# EAGLE schematic DEPDisc Base rev1 v4 (EAGLE 9.7.0)
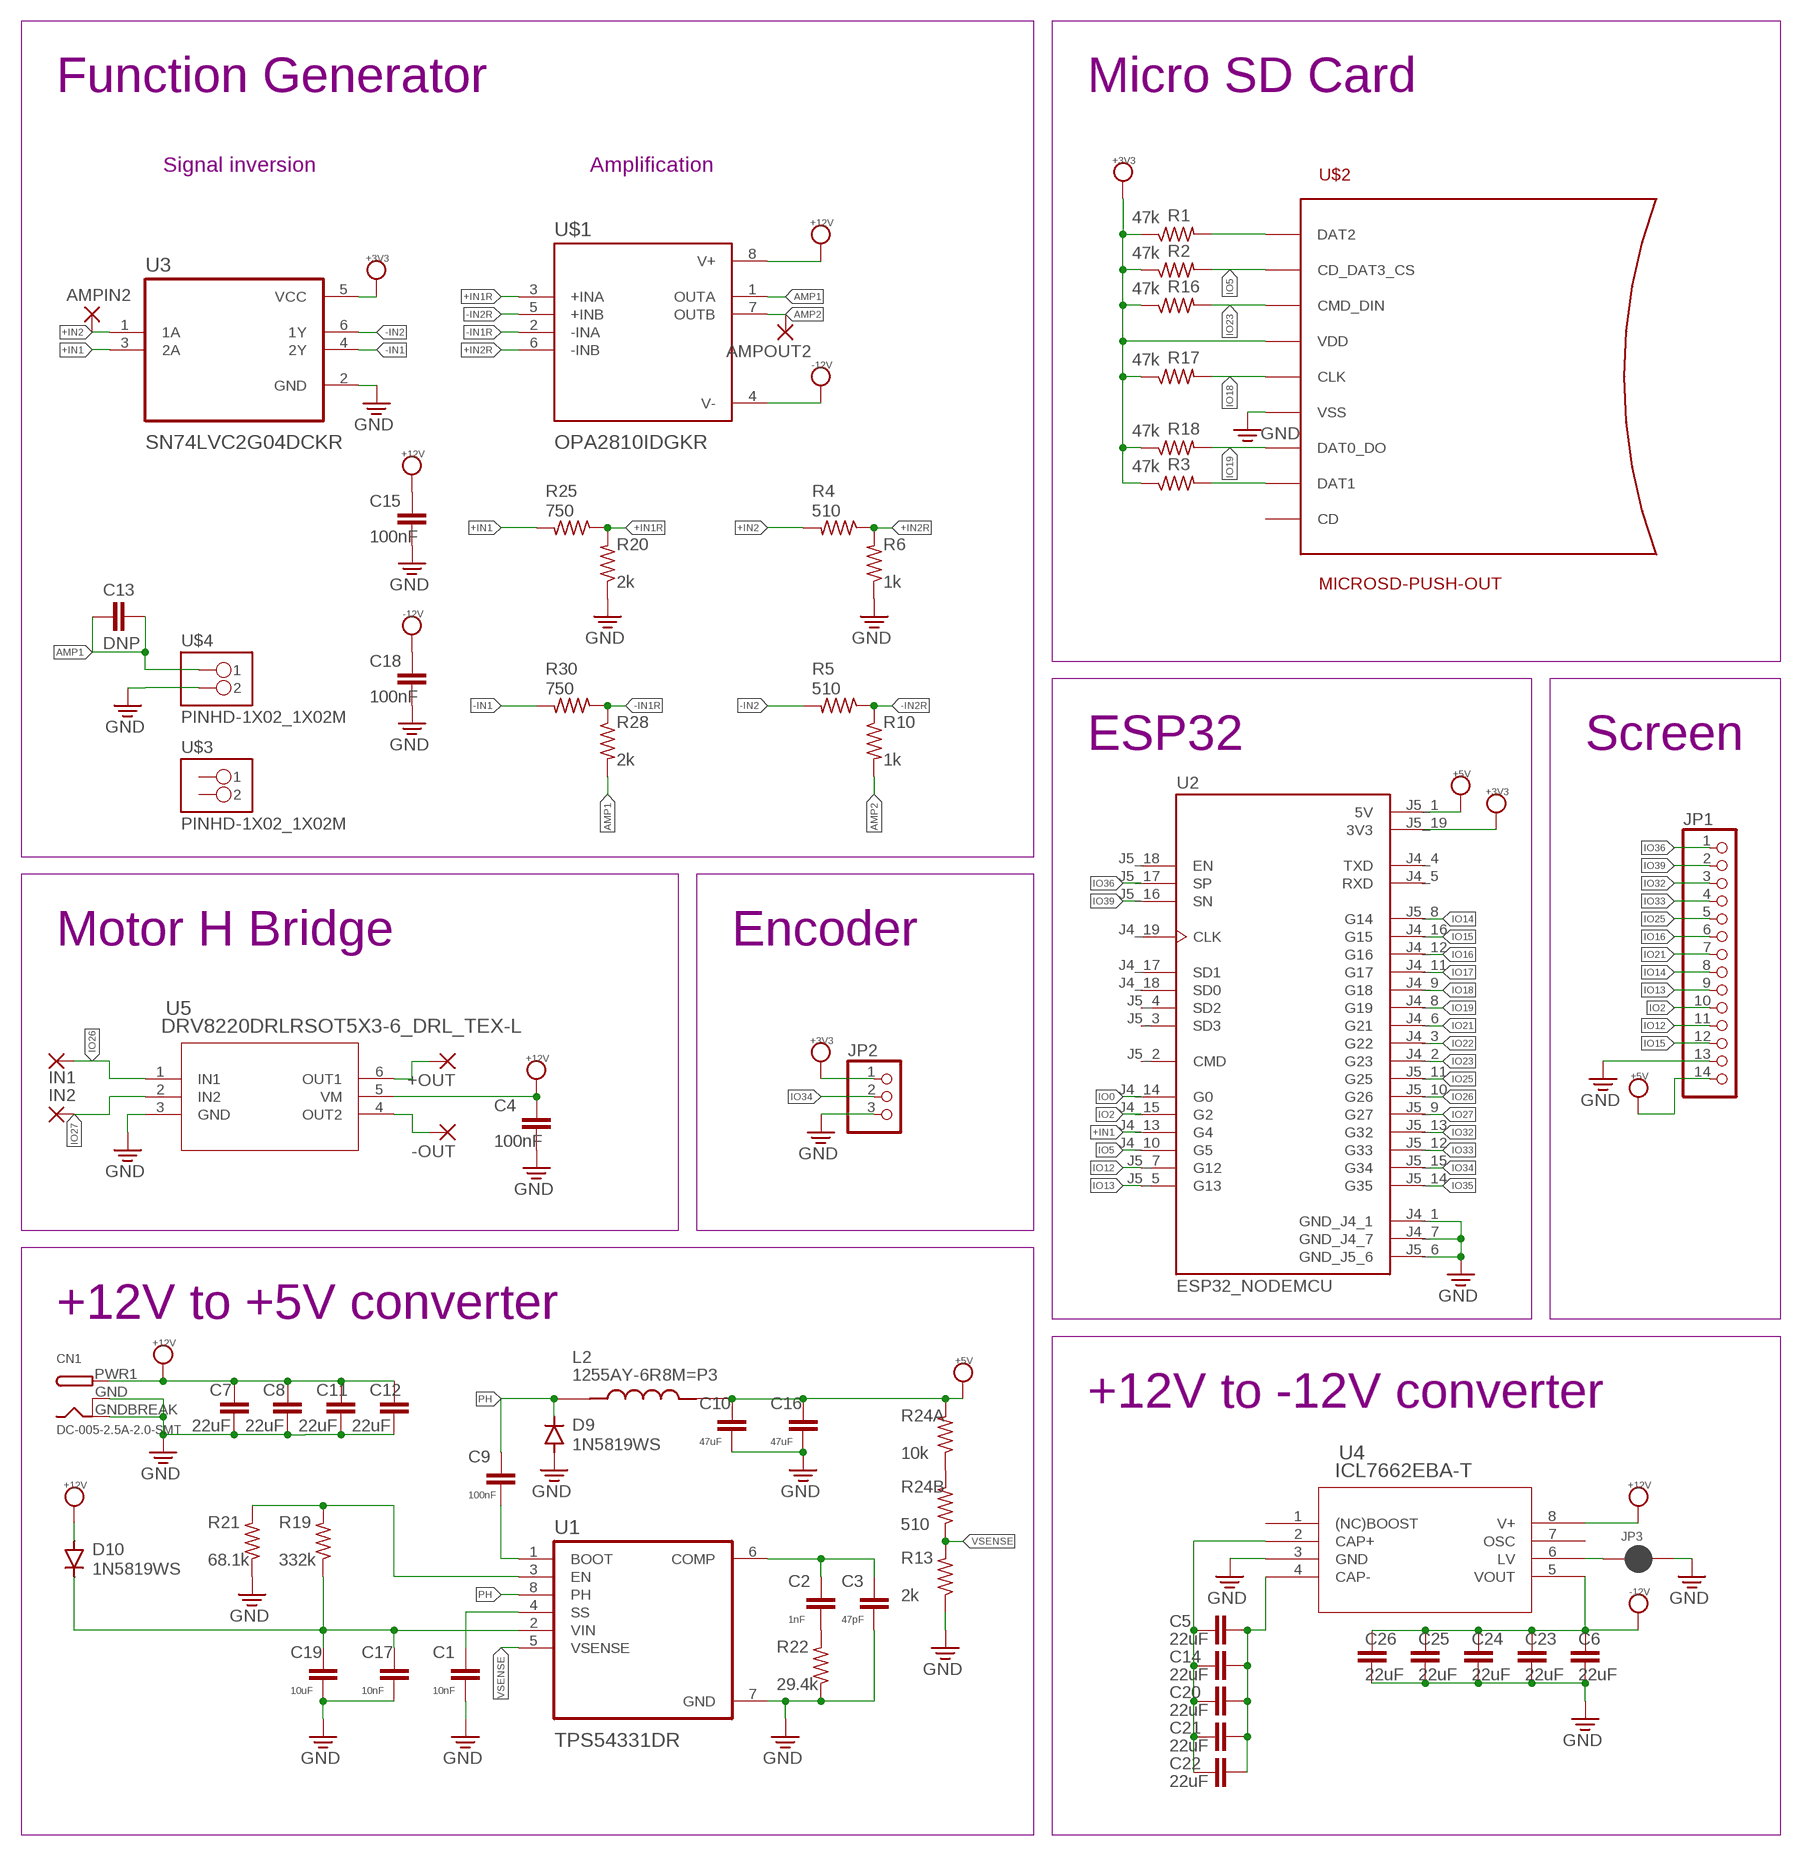
[diagram p0: schematic, sheet 1]

## Parts
+OUT  2,54/1,1  [2,54/1,1]
-OUT  2,54/1,1  [2,54/1,1]
AMPIN2  1,6/0,8  [1,6/0,8]
AMPOUT2  1,6/0,8  [1,6/0,8]
C1  10nF  C-EUC0603K  [C0603K]
C2  1nF  C-EUC0603K  [C0603K]
C3  47pF  C-EUC0603K  [C0603K]
C4  100nF  C-EUC0603K  [C0603K]
C5  22uF  C-EUC0805K  [C0805K]
C6  22uF  C-EUC0805K  [C0805K]
C7  22uF  C-EUC0805K  [C0805K]
C8  22uF  C-EUC0805K  [C0805K]
C9  100nF  C-EUC0603K  [C0603K]
C10  47uF  C-EUC0603K  [C0603K]
C11  22uF  C-EUC0805K  [C0805K]
C12  22uF  C-EUC0805K  [C0805K]
C13  DNP  C-EUC0805K  [C0805K]
C14  22uF  C-EUC0805K  [C0805K]
C15  100nF  C-EUC0603K  [C0603K]
C16  47uF  C-EUC0603K  [C0603K]
C17  10nF  C-EUC0603K  [C0603K]
C18  100nF  C-EUC0603K  [C0603K]
C19  10uF  C-EUC0603K  [C0603K]
C20  22uF  C-EUC0805K  [C0805K]
C21  22uF  C-EUC0805K  [C0805K]
C22  22uF  C-EUC0805K  [C0805K]
C23  22uF  C-EUC0805K  [C0805K]
C24  22uF  C-EUC0805K  [C0805K]
C25  22uF  C-EUC0805K  [C0805K]
C26  22uF  C-EUC0805K  [C0805K]
CN1  DC-005-2.5A-2.0-SMT  DCBARRELSMT  [DCJACK_2MM_SMT]
D9  1N5819WS  DIODE-SOD323-W  [SOD323-W]
D10  1N5819WS  DIODE-SOD323-W  [SOD323-W]
IN1  2,54/1,1  [2,54/1,1]
IN2  2,54/1,1  [2,54/1,1]
JP1  PINHD-1X14  [1X14]
JP2  PINHD-1X3  [1X03]
JP3  JUMPER-SMT_2_NC_PASTE_SILK  [SMT-JUMPER_2_NC_PASTE_SILK]
L2  1255AY-6R8M=P3  [IND_1255AY-6R8M=P3]
R1  47k  R-US_R0603  [R0603]
R2  47k  R-US_R0603  [R0603]
R3  47k  R-US_R0603  [R0603]
R4  510  R-US_R0603  [R0603]
R5  510  R-US_R0603  [R0603]
R6  1k  R-US_R0603  [R0603]
R10  1k  R-US_R0603  [R0603]
R13  2k  R-US_R0603  [R0603]
R16  47k  R-US_R0603  [R0603]
R17  47k  R-US_R0603  [R0603]
R18  47k  R-US_R0603  [R0603]
R19  332k  R-US_R0603  [R0603]
R20  2k  R-US_R0603  [R0603]
R21  68.1k  R-US_R0603  [R0603]
R22  29.4k  R-US_R0603  [R0603]
R24A  10k  R-US_R0603  [R0603]
R24B  510  R-US_R0603  [R0603]
R25  750  R-US_R0603  [R0603]
R28  2k  R-US_R0603  [R0603]
R30  750  R-US_R0603  [R0603]
U1  TPS54331DR  [SOIC127P599X175-8N]
U2  ESP32_NODEMCU  [MODULE_ESP32_NODEMCU]
U3  SN74LVC2G04DCKR  [SOT65P210X110-6N]
U4  ICL7662EBA-T  [21-0041B_8]
U5  DRV8220DRLRSOT5X3-6_DRL_TEX-L  [SOT5X3-6_DRL_TEX-L]
U$1  OPA2810IDGKR  [SOP65P490X110-8N]
U$2  MICROSD-PUSH-OUT  [MICROSD-PUSH-OUT]
U$3  PINHD-1X02_1X02M  [1X02]
U$4  PINHD-1X02_1X02M  [1X02]

## Nets
+3V3: JP2.1 R1.1 R2.1 R3.1 R16.1 R17.1 R18.1 U2.J5_19(3V3) U3.5(VCC) U$2.4(VDD)
+5V: C10.1 C16.1 JP1.14 L2.2 R24A.2 U2.J5_1(5V)
+12V: C4.1 C7.2 C8.2 C11.2 C12.2 C15.1 CN1.PWR1(PWR) D10.A U4.8(V+) U5.5(VM) U$1.8(V+)
+IN1: R25.2 U2.J4_13(G4) U3.3(2A)
+IN1R: R20.2 R25.1 U$1.3(+INA)
+IN2: AMPIN2.1(P) R4.2 U3.1(1A)
+IN2R: R4.1 R6.2 U$1.6(-INB)
-12V: C6.2 C18.1 C23.2 C24.2 C25.2 C26.2 U4.5(VOUT) U$1.4(V-)
-IN1: R30.2 U3.4(2Y)
-IN1R: R28.1 R30.1 U$1.2(-INA)
-IN2: R5.2 U3.6(1Y)
-IN2R: R5.1 R10.1 U$1.5(+INB)
AMP1: C13.1 C13.2 R28.2 U$1.1(OUTA) U$4.1
AMP2: AMPOUT2.1(P) R10.2 U$1.7(OUTB)
DAT2: R1.2 U$2.1(DAT2)
GND: C1.2 C3.2 C4.2 C6.1 C7.1 C8.1 C10.2 C11.1 C12.1 C15.2 C16.2 C17.2 C18.2 C19.2 C23.1 C24.1 C25.1 C26.1 CN1.GND(GNDBREAK) CN1.GNDBREAK(GND) D9.A JP1.13 JP2.3 JP3.2 R6.1 R13.1 R20.1 R21.1 R22.1 U1.7(GND) U2.J4_1(GND_J4_1) U2.J4_7(GND_J4_7) U2.J5_6(GND_J5_6) U3.2(GND) U4.3(GND) U5.3(GND) U$2.6(VSS) U$2.G1(VSS) U$2.G2(VSS) U$2.G3(VSS) U$2.G4(VSS) U$4.2
IO0: U2.J4_14(G0)
IO2: JP1.10 U2.J4_15(G2)
IO5: R2.2 U2.J4_10(G5) U$2.2(CD_DAT3_CS)
IO12: JP1.11 U2.J5_7(G12)
IO13: JP1.9 U2.J5_5(G13)
IO14: JP1.8 U2.J5_8(G14)
IO15: JP1.12 U2.J4_16(G15)
IO16: JP1.6 U2.J4_12(G16)
IO17: U2.J4_11(G17)
IO18: R17.2 U2.J4_9(G18) U$2.5(CLK)
IO19: R18.2 U2.J4_8(G19) U$2.7(DAT0_DO)
IO21: JP1.7 U2.J4_6(G21)
IO22: U2.J4_3(G22)
IO23: R16.2 U2.J4_2(G23) U$2.3(CMD_DIN)
IO25: JP1.5 U2.J5_11(G25)
IO26: IN1.1(P) U2.J5_10(G26) U5.1(IN1)
IO27: IN2.1(P) U2.J5_9(G27) U5.2(IN2)
IO32: JP1.3 U2.J5_13(G32)
IO33: JP1.4 U2.J5_12(G33)
IO34: JP2.2 U2.J5_15(G34)
IO35: U2.J5_14(G35)
IO36: JP1.1 U2.J5_17(SP)
IO39: JP1.2 U2.J5_16(SN)
N$1: C5.2 C14.2 C20.2 C21.2 C22.2 U4.2(CAP+)
N$2: C5.1 C14.1 C20.1 C21.1 C22.1 U4.4(CAP-)
N$3: +OUT.1(P) U5.6(OUT1)
N$4: -OUT.1(P) U5.4(OUT2)
N$5: JP3.1 U4.6(LV)
N$7: R19.2 R21.2 U1.3(EN)
N$8: C1.1 U1.4(SS)
N$9: R3.2 U$2.8(DAT1)
N$10: C2.1 C3.1 U1.6(COMP)
N$11: C2.2 R22.2
N$14: R24A.1 R24B.2
N$30: C9.2 U1.1(BOOT)
N$35: C17.1 C19.1 D10.C R19.1 U1.2(VIN)
PH: C9.1 D9.C L2.1 U1.8(PH)
VSENSE: R13.2 R24B.1 U1.5(VSENSE)
Unconnected: U2.J4_4(TXD) U2.J4_5(RXD) U2.J4_17(SD1) U2.J4_18(SD0) U2.J4_19(CLK) U2.J5_2(CMD) U2.J5_3(SD3) U2.J5_4(SD2) U2.J5_18(EN) U4.1((NC)BOOST) U4.7(OSC) U$2.CD U$3.1 U$3.2

## Notes on the sheet
- Function Generator | Micro SD Card
- Signal inversion | Amplification
- ESP32 | Screen
- Motor H Bridge | Encoder
- +12V to +5V converter
- +12V to -12V converter

## Library data of the parts
+OUT -OUT IN1 IN2 = wirepad:2,54/1,1: THROUGH-HOLE PAD
AMPIN2 AMPOUT2 = wirepad:1,6/0,8: THROUGH-HOLE PAD
C1-C3 C9 C10 C13 C16 C17 C19 = resistor:C-EU: CAPACITOR, European symbol
C4-C8 C11 C12 C14 C15 C18 C20-C26 = rcl:C-EU: CAPACITOR, European symbol; SPICEPREFIX: C
CN1 = adafruit:DCBARREL: 2.0mm DC Barrel Jack DCJACK_2MM_PTH - Through Hole Jack (4UConnector: 05537)
D9 D10 = diode:DIODE-: DIODE
JP1 = pinhead:PINHD-1X14: PIN HEADER
JP2 = pinhead:PINHD-1X3: PIN HEADER
JP3 = SparkFun-Jumpers:JUMPER-SMT_2_NC_PASTE: Normally closed solder jumper This jumper has an aperture in the stencil to allow solder paste to bridge the split in the wire so it's normally closed (NC). Wick off the solder to open the connection. Reapply solder to reclose the connection.
L2 = 1255AY-6R8M=P3:1255AY-6R8M=P3: 3.9µH Shielded Wirewound Inductor 4.2A 26.4mOhm Max Nonstandard Check availability <https://pricing.snapeda.com/parts/1255AY-6R8M%3DP3/Murata%20Electronics/view-part?ref=eda>; AVAILABILITY: Not in stock; CHECK_PRICES: https://www.snapeda.com/parts/1255AY-6R8M=P3/Murata+Electronics+North+America/view-part/?ref=eda; DESCRIPTION: 6.8 µH Shielded Drum Core, Wirewound Inductor 3.4 A 36mOhm Nonstandard; MF: Murata Electronics; MP: 1255AY-6R8M=P3; PACKAGE: NONSTANDARD; PRICE: None; PURCHASE-URL: https://www.snapeda.com/api/url_track_click_mouser/?unipart_id=1508412&manufacturer=Murata Electronics&part_name=1255AY-6R8M=P3&search_term=1255ay-6r8m=p3; SNAPEDA_LINK: https://www.snapeda.com/parts/1255AY-6R8M=P3/Murata+Electronics+North+America/view-part/?ref=snap
R1-R6 R10 R13 R16-R22 R24A R24B R25 R28 R30 = resistor:R-US_: RESISTOR, American symbol
U1 = TPS54331DR:TPS54331DR: Check availability <https://pricing.snapeda.com/parts/TPS54331DR/Texas%20Instruments/view-part?ref=eda>; AVAILABILITY: In Stock; CHECK_PRICES: https://www.snapeda.com/parts/TPS54331DR/Texas+Instruments/view-part/?ref=eda; DESCRIPTION: 3.5V to 28V Input, 3A, 570kHz Step-Down Converter with Eco-mode; MF: Texas Instruments; MP: TPS54331DR; PACKAGE: SOIC-8 Texas Instruments; PRICE: None; PURCHASE-URL: https://www.snapeda.com/api/url_track_click_mouser/?unipart_id=490779&manufacturer=Texas Instruments&part_name=TPS54331DR&search_term=tps54331dr; SNAPEDA_LINK: https://www.snapeda.com/parts/TPS54331DR/Texas+Instruments/view-part/?ref=snap
U2 = ESP32_NODEMCU:ESP32_NODEMCU: Check availability <https://pricing.snapeda.com/parts/ESP32%20NODEMCU/AZ%20Delivery/view-part?ref=eda>; AVAILABILITY: Not in stock; CHECK_PRICES: https://www.snapeda.com/parts/ESP32%20NODEMCU/AZ-Delivery/view-part/?ref=eda; DESCRIPTION: NodeMCU is an open source loT platform. ESP32 is a series of low cost, low power system-on-chip (SoC) microcontrollers with integrated Wi-Fi & dual-mode Bluetooth.; MF: AZ Delivery; MP: ESP32 NODEMCU; PACKAGE: Package; PRICE: None; SNAPEDA_LINK: https://www.snapeda.com/parts/ESP32%20NODEMCU/AZ-Delivery/view-part/?ref=snap
U3 = SN74LVC2G04DCKR:SN74LVC2G04DCKR: Check availability <https://pricing.snapeda.com/parts/SN74LVC2G04DCKR/Texas%20Instruments/view-part?ref=eda>; AVAILABILITY: In Stock; CHECK_PRICES: https://www.snapeda.com/parts/SN74LVC2G04DCKR/Texas+Instruments/view-part/?ref=eda; DESCRIPTION: 2-ch, 1.65-V to 5.5-V inverters; MF: Texas Instruments; MP: SN74LVC2G04DCKR; PACKAGE: SOT-SC70-6 Texas Instruments; PRICE: None; PURCHASE-URL: https://www.snapeda.com/api/url_track_click_mouser/?unipart_id=386869&manufacturer=Texas Instruments&part_name=SN74LVC2G04DCKR&search_term=sn74lvc2g04; SNAPEDA_LINK: https://www.snapeda.com/parts/SN74LVC2G04DCKR/Texas+Instruments/view-part/?ref=snap
U4 = ICL7662EBA-T:ICL7662EBA-T: Check availability <https://pricing.snapeda.com/parts/ICL7662EBA%2BT/Analog%20Devices/view-part?ref=eda>; AVAILABILITY: In Stock; CHECK_PRICES: https://www.snapeda.com/parts/ICL7662EBA+T/Analog+Devices/view-part/?ref=eda; DESCRIPTION: CMOS, Voltage Converters; MF: Analog Devices; MP: ICL7662EBA+T; PACKAGE: SOIC-8 Maxim; PRICE: None; PURCHASE-URL: https://www.snapeda.com/api/url_track_click_mouser/?unipart_id=650098&manufacturer=Analog Devices&part_name=ICL7662EBA+T&search_term=icl7662; SNAPEDA_LINK: https://www.snapeda.com/parts/ICL7662EBA+T/Analog+Devices/view-part/?ref=snap
U5 = DRV8220DRLR:DRV8220DRLR; COPYRIGHT: Copyright (C) 2024 Ultra Librarian. All rights reserved.; MANUFACTURER_PART_NUMBER: DRV8220DRLR; MFR_NAME: Texas Instruments; TYPE: Power Management
U$1 = OPA2810IDGKR:OPA2810IDGKR: High Performance Low Cost Rail-to-Rail Input/Output HV FET Op Amps Source: Datasheet <http://www.ti.com/lit/gpn/opa2810>; DESCRIPTION: High Performance Low Cost Rail-to-Rail Input/Output HV FET Op Amps; HEIGHT: 1.1mm; MANUFACTURER_NAME: Texas Instruments; MANUFACTURER_PART_NUMBER: OPA2810IDGKR; MOUSER_PART_NUMBER: 595-OPA2810IDGKR; MOUSER_PRICE-STOCK: https://www.mouser.co.uk/ProductDetail/Texas-Instruments/OPA2810IDGKR?qs=YCa%2FAAYMW02J4dMmTpJlwg%3D%3D
U$2 = TF-012-P9:MICROSD-PUSH-OUT: T-Flash Push-Out Micro SD Card Reader 14.75mm x 14.5mm SMD with external pins
U$3 U$4 = Tinkercad:PINHD-1X02